# EAGLE design switch_7btn (EAGLE 6.6.0)
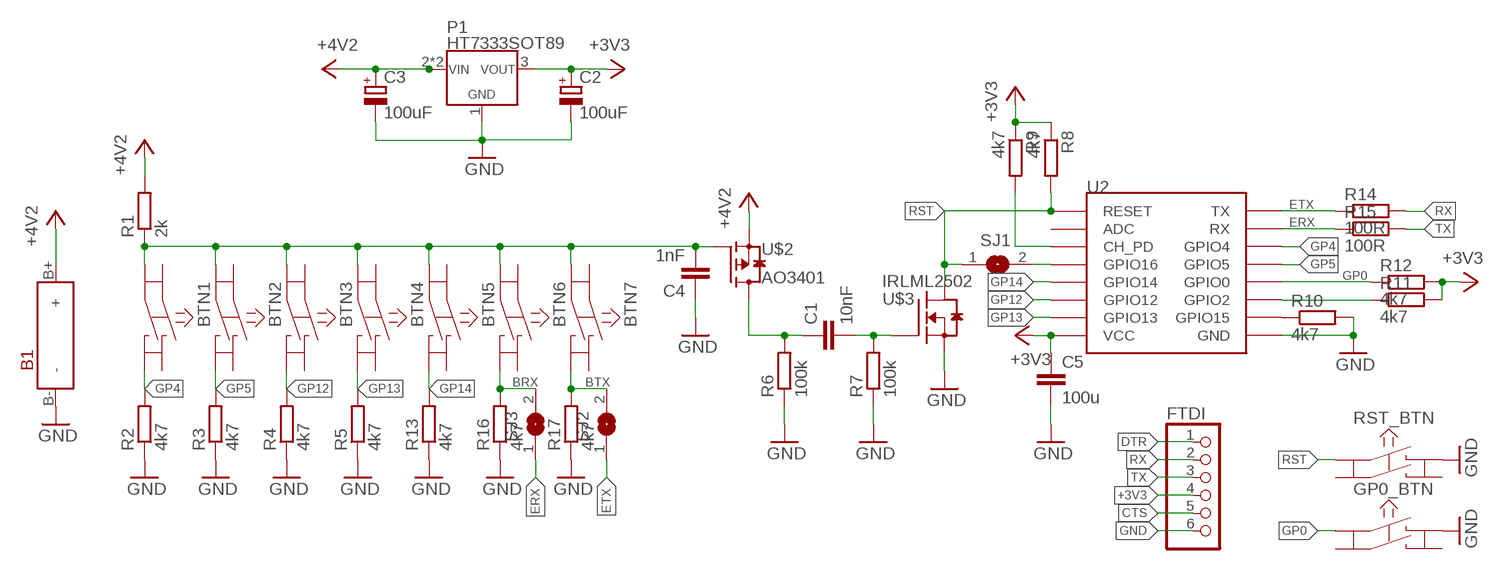
[diagram p0: schematic, sheet 1]

## Parts
B1  18650_1X  [18650_HOLDER_1X]
BTN1  KSM611A  [KSM611A]
BTN2  KSM611A  [KSM611A]
BTN3  KSM611A  [KSM611A]
BTN4  KSM611A  [KSM611A]
BTN5  KSM611A  [KSM611A]
BTN6  KSM611A  [KSM611A]
BTN7  KSM611A  [KSM611A]
C1  10nF  C-EU025-025X050  [C025-025X050]
C2  100uF  CPOL-EUE5-8.5  [E5-8,5]
C3  100uF  CPOL-EUE5-8.5  [E5-8,5]
C4  1nF  C-EU025-025X050  [C025-025X050]
C5  100u  C-EUC1206  [C1206]
FTDI  PINHD-1X06_2.54-S  [1X06-S]
GP0_BTN  KSM611A  [KSM611A]
P1  HT7333SOT89  [SOT89]
R1  2k  R-EU_MULTI  [MULTI_RESISTOR]
R2  4k7  R-EU_MULTI  [MULTI_RESISTOR]
R3  4k7  R-EU_MULTI  [MULTI_RESISTOR]
R4  4k7  R-EU_MULTI  [MULTI_RESISTOR]
R5  4k7  R-EU_MULTI  [MULTI_RESISTOR]
R6  100k  R-EU_MULTI  [MULTI_RESISTOR]
R7  100k  R-EU_MULTI  [MULTI_RESISTOR]
R8  4k7  R-EU_MULTI  [MULTI_RESISTOR]
R9  4k7  R-EU_MULTI  [MULTI_RESISTOR]
R10  4k7  R-EU_MULTI  [MULTI_RESISTOR]
R11  4k7  R-EU_MULTI  [MULTI_RESISTOR]
R12  4k7  R-EU_MULTI  [MULTI_RESISTOR]
R13  4k7  R-EU_MULTI  [MULTI_RESISTOR]
R14  100R  R-EU_MULTI  [MULTI_RESISTOR]
R15  100R  R-EU_MULTI  [MULTI_RESISTOR]
R16  4k7  R-EU_MULTI  [MULTI_RESISTOR]
R17  4k7  R-EU_MULTI  [MULTI_RESISTOR]
RST_BTN  KSM611A  [KSM611A]
SJ1  SJ  [SJ]
SJ2  SJ  [SJ]
SJ3  SJ  [SJ]
U2  ESP12SMD  [ESP12-SMD]
U$2  AO3401  P-CH_AO3401  [SOT23]
U$3  IRLML2502  N-CH_IRLML2502  [SOT23]

## Nets
+3V3: C2.+ C5.1 FTDI.4 P1.3(VOUT) R8.1@1 R8.1@2 R9.1@1 R9.1@2 R11.2@1 R11.2@2 R12.2@1 R12.2@2 U2.VCC
+5V: B1.B+(+) C3.+ P1.2(VIN) P1.2@1(VIN) R1.2@1 R1.2@2 U$2.2(S) ; supply symbol labelled +4V2
BRX: BTN6.D R16.2@1 R16.2@2 SJ3.2
BTX: BTN7.D R17.2@1 R17.2@2 SJ2.2
CTS: FTDI.5
DTR: FTDI.1
ERX: R15.1@1 R15.1@2 SJ3.1 U2.RXD0(RX)
ETX: R14.1@1 R14.1@2 SJ2.1 U2.TXD0(TX)
GND: B1.B-(-) C2.- C3.- C4.1 C5.2 FTDI.6 GP0_BTN.B P1.1(GND) R2.1@1 R2.1@2 R3.1@1 R3.1@2 R4.1@1 R4.1@2 R5.1@1 R5.1@2 R6.1@1 R6.1@2 R7.1@1 R7.1@2 R10.2@1 R10.2@2 R13.1@1 R13.1@2 R16.1@1 R16.1@2 R17.1@1 R17.1@2 RST_BTN.B U2.GND U$3.2(S)
GP0: GP0_BTN.A R12.1@1 R12.1@2 U2.GPIO0
GP4: BTN1.D R2.2@1 R2.2@2 U2.GPIO4
GP5: BTN2.D R3.2@1 R3.2@2 U2.GPIO5
GP12: BTN3.D R4.2@1 R4.2@2 U2.GPIO12
GP13: BTN4.D R5.2@1 R5.2@2 U2.GPIO13
GP14: BTN5.D R13.2@1 R13.2@2 U2.GPIO14
N$1: SJ1.2 U2.GPIO16
N$2: R9.2@1 R9.2@2 U2.CH_PD
N$3: C1.2 R7.2@1 R7.2@2 U$3.1(G)
N$4: R10.1@1 R10.1@2 U2.GPIO15
N$5: R11.1@1 R11.1@2 U2.GPIO2
N$7: C1.1 R6.2@1 R6.2@2 U$2.3(D)
N$8: BTN1.C BTN2.C BTN3.C BTN4.C BTN5.C BTN6.C BTN7.C C4.2 R1.1@1 R1.1@2 U$2.1(G)
RST: R8.2@1 R8.2@2 RST_BTN.A SJ1.1 U2.RESET U$3.3(D)
RX: FTDI.2 R14.2@1 R14.2@2
TX: FTDI.3 R15.2@1 R15.2@2
Unconnected: BTN1.A BTN1.B BTN2.A BTN2.B BTN3.A BTN3.B BTN4.A BTN4.B BTN5.A BTN5.B BTN6.A BTN6.B BTN7.A BTN7.B GP0_BTN.C GP0_BTN.D RST_BTN.C RST_BTN.D U2.ADC

## Library data of the parts
B1 = diyHue:18650_1X
BTN1-BTN7 GP0_BTN RST_BTN = schalter_taster:KSM611A
C1 C4 C5 = rcl:C-EU: CAPACITOR, European symbol
C2 C3 = rcl:CPOL-EU: POLARIZED CAPACITOR, European symbol
FTDI = pinhead-2:PINHD-1X06: PIN HEADER
P1 = diyHue:HT7333
R1-R17 = diyHue:R-EU_MULTI
SJ1-SJ3 = jumper:SJ: SMD solder JUMPER
U2 = esp8266modules:ESP12: ESP8266 Wifi module 12
U$2 = diyHue:P-CH_AO3401
U$3 = diyHue:N-CH_IRLML2502

## Board
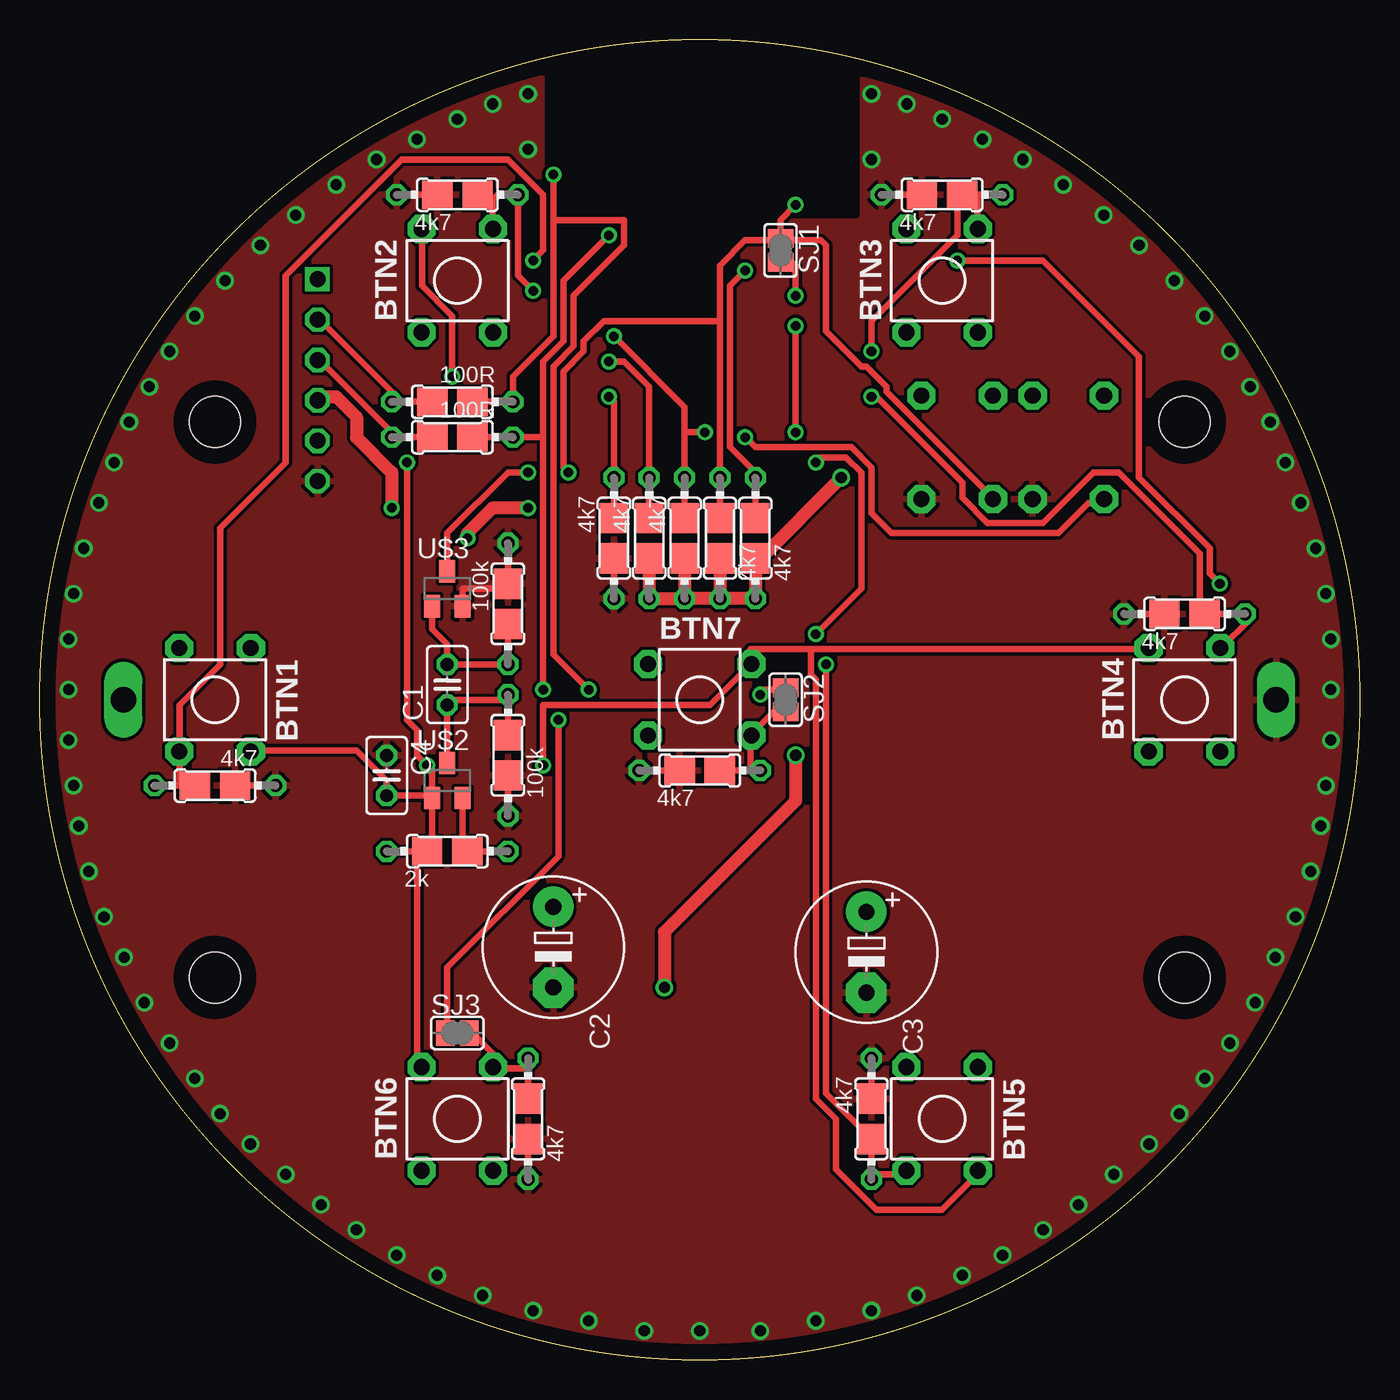
[diagram p1: board, top side]
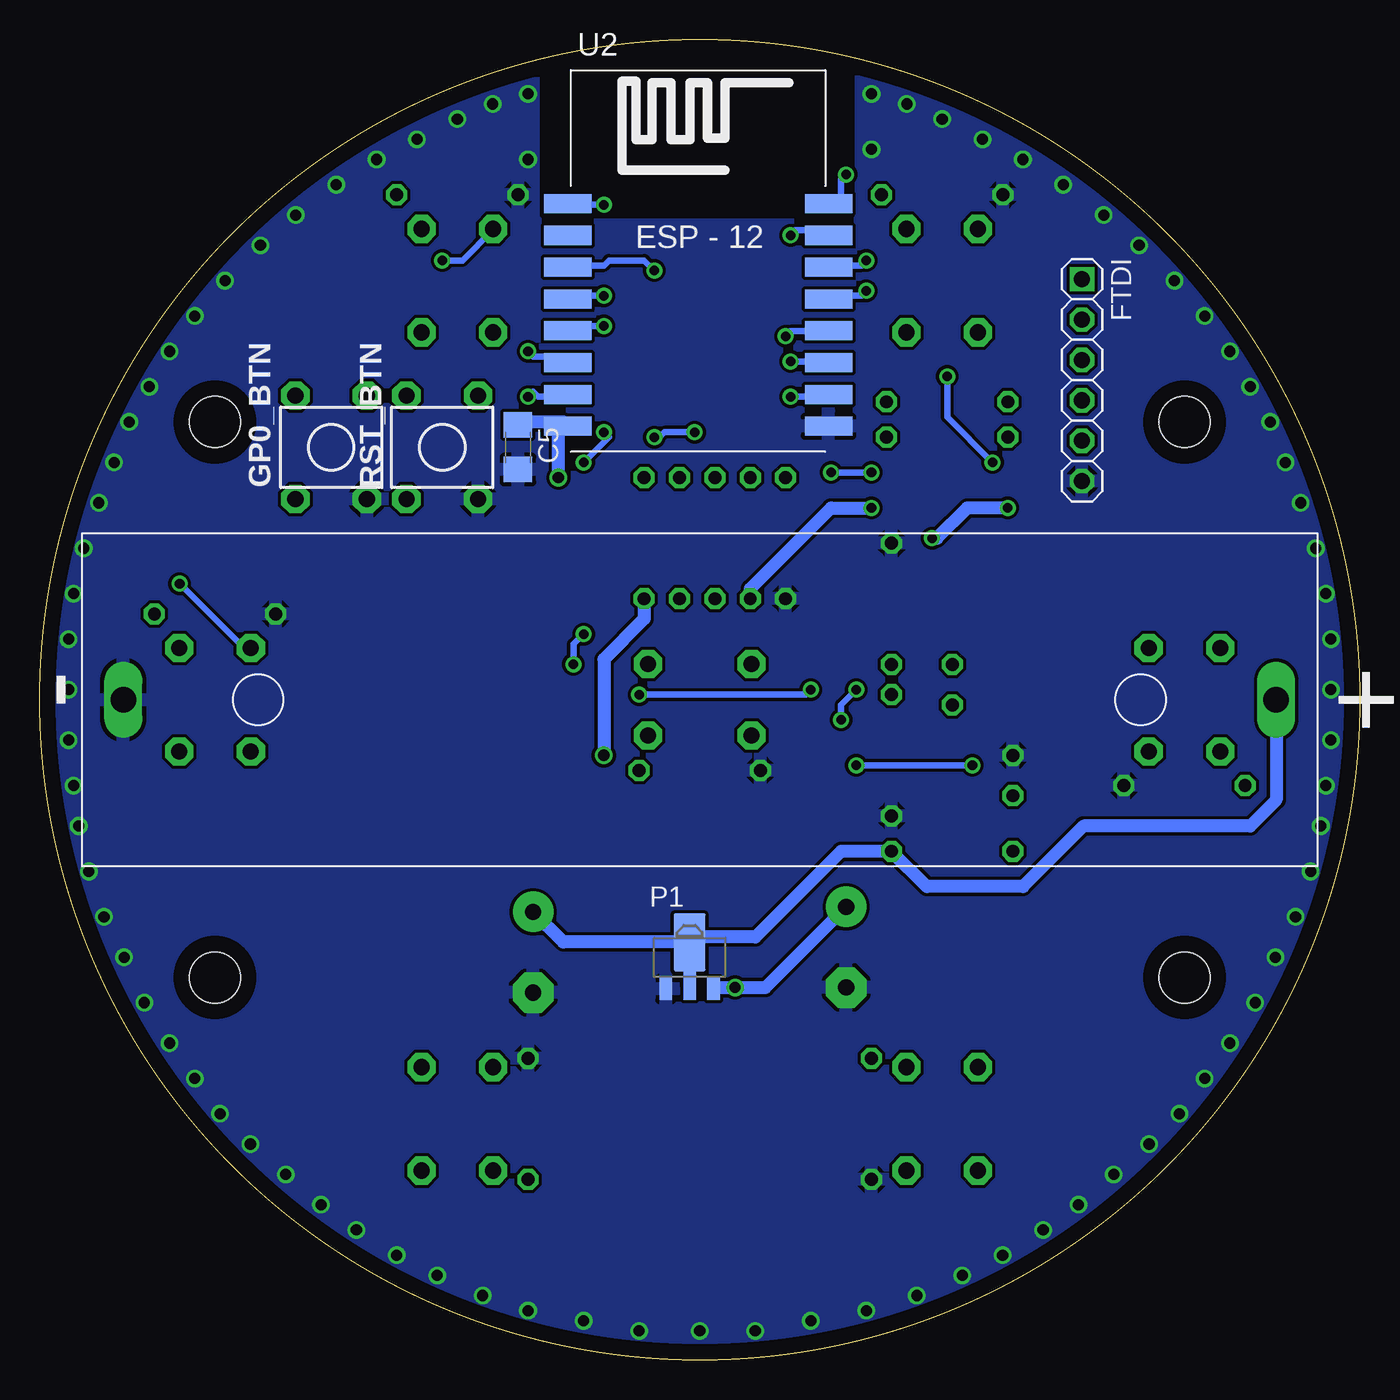
[diagram p2: board, bottom side, seen from below]

Size 83 x 83 mm. Coordinates in mm from the lower left corner, seen from the top.
Outline: circle at 41.5,41.5 radius 41.5
Copper layers (1*16): Top 0.035mm / dielectric 1.5mm / Bottom 0.035mm
Design rules "default *": minimum track width 10mil, minimum drill 0.5mm, track to track 8mil, track to pad 8mil, pad to pad 8mil, via to via 8mil, smd to smd 0mil, copper to edge 1mm, drill to drill 8mil, minimum pad ring 10mil, minimum via ring 8mil, stop-mask expansion 4mil, vias tented up to drill 1mm, thermal gap 10mil
Holes 3.2 mm at 11.02,24.04 71.98,24.04 71.98,58.96 11.02,58.96

### Footprints (pad centres in the part's own frame; a part is rotated, then mirrored left to right if it is on the bottom)
18650_HOLDER_1X = drill 1.6 long: B+ 37.52,0; B- -34.98,0
KSM611A = drill 1.016 pad 1.778 octagon: A -3.25,2.25; B -3.25,-2.25; C 3.25,2.25; D 3.25,-2.25
C025-025X050 = drill 0.813 octagon: 1 -1.27,0; 2 1.27,0
E5-8,5 = drill 1.016 pad 2.54: + -2.54,0 | drill 1.016 pad 2.54 octagon: - 2.54,0
C1206 = smd 1.6 x 1.8: 1 -1.4,0; 2 1.4,0
1X06-S = drill 1.016 square: 1 -6.35,0 | drill 1.016 octagon: 2 -3.81,0; 3 -1.27,0; 4 1.27,0; 5 3.81,0; 6 6.35,0
SOT89 = smd 0.8 x 1.4: 1 -1.499,-1.981; 3 1.499,-1.981 | smd 0.8 x 1.9: 2 0,-1.727 | smd 2.032 x 3.65: 2@1 0,0.94
MULTI_RESISTOR = drill 0.813 octagon: 1@1 -3.81,0; 2@1 3.81,0 | smd 1.905 x 1.803: 1@2 -1.266,0; 2@2 1.266,0
SJ = smd 1.168 x 1.6: 1 -0.762,0; 2 0.762,0
ESP12-SMD = smd 3 x 1.2: ADC -8.3,3.8; CH_PD -8.3,1.8; GND 8.1,-8.2; GPIO0 8.1,-2.2; GPIO2 8.1,-4.2; GPIO4 8.1,1.8; GPIO5 8.1,-0.2; GPIO12 -8.3,-4.2; GPIO13 -8.3,-6.2; GPIO14 -8.3,-2.2; GPIO15 8.1,-6.2; GPIO16 -8.3,-0.2; RESET -8.3,5.8; RXD0 8.1,3.8; TXD0 8.1,5.8; VCC -8.3,-8.2
SOT23 = smd 1 x 1.4: 1 -0.95,-1.1; 2 0.95,-1.1; 3 0,1.1

### Placement (x,y rotation side)
B1  42.77,41.5 0 bottom
BTN1  11.02,41.5 270 top
BTN2  26.26,67.85 90 top
BTN3  56.74,67.85 90 top
BTN4  71.98,41.5 90 top
BTN5  56.74,15.15 270 top
BTN6  26.26,15.15 90 top
BTN7  41.5,41.5 0 top
C1  25.62,42.45 90 top
C2  32.29,25.94 270 top
C3  51.98,25.62 270 top
C4  21.82,36.74 270 top
C5  52.93,57.38 270 bottom
FTDI  17.46,61.6 270 bottom
GP0_BTN  64.68,57.38 90 bottom
P1  42.13,25.31 0 bottom
R1  25.62,31.98 0 top
R2  11.02,36.1 180 top
R3  26.26,73.25 0 top
R4  56.74,73.25 0 top
R5  71.98,46.9 0 top
R6  29.44,38.01 90 top
R7  29.44,47.53 270 top
R8  42.77,51.66 90 top
R9  44.99,51.66 90 top
R10  36.1,51.66 270 top
R11  38.33,51.66 270 top
R12  40.55,51.66 270 top
R13  52.3,15.15 270 top
R14  25.94,60.23 180 top
R15  25.94,58.01 180 top
R16  30.7,15.15 90 top
R17  41.5,37.05 0 top
RST_BTN  57.69,57.38 90 bottom
SJ1  46.58,69.76 270 top
SJ2  46.9,41.5 270 top
SJ3  26.26,20.55 0 top
U2  41.5,66.9 0 bottom
U$2  25.62,36.42 0 top
U$3  25.62,48.48 0 top

### Tracks (layer width: path | path; a pad name or v marks a point on that pad's centre or on a via)
+3V3  (via drill 0.6, 0.7)
  Top 0.813: R12.2@1 R11.2@1 R11.2@2 | R8.1@1 R12.2@1 | R8.1@1 R9.1@1 R9.1@2 45.31,50.39 v50.39,55.47 | R8.1@2 R8.1@1 | R12.2@2 R12.2@1 | v39.28,23.4 39.28,26.89 47.53,35.15 v47.53,38.01 | v22.13,53.56 22.13,55.79 19.91,58.01 19.91,59.28 18.64,60.55 17.69,60.55 FTDI.4 | v26.89,51.66 26.89,51.98 28.48,53.56 v30.7,53.56
  Bottom 0.813: C5.1 52.93,58.96 50.07,58.96 U2.VCC 50.39,58.64 v50.39,55.47 | C2.+ 37.37,23.4 v39.28,23.4 40.55,23.4 P1.3 | v47.53,38.01 47.53,44.04 44.99,46.58 R9.1@1 | v22.13,53.56 24.67,53.56 26.58,51.66 v26.89,51.66 | v30.7,53.56 33.24,53.56 38.33,48.48 R11.2@1
+5V
  Top 0.406: R1.2@1 R1.2@2 26.58,31.98 26.58,35.15 U$2.2
  Bottom 0.813: P1.2@1 P1.2 | C3.+ 50.07,26.26 42.77,26.26 42.45,26.58 42.13,26.58 P1.2@1 | P1.2@1 41.82,26.58 38.01,26.58 32.61,31.98 R1.2@1 27.21,29.75 21.18,29.75 17.37,33.56 6.89,33.56 5.25,35.2 B1.B+
BRX
  Top 0.406: 30.7,18.32 R16.2@2 | 30.7,18.32 28.8,18.32 BTN6.D 28.48,18.64 28.48,19.27 27.21,20.55 SJ3.2 | 30.7,18.32 R16.2@1
BTX
  Top 0.406: 44.67,37.05 R17.2@2 | 44.67,37.05 44.67,38.96 BTN7.D 44.67,39.28 46.26,40.87 46.9,40.87 SJ2.2 | 44.67,37.05 R17.2@1
ERX  (via drill 0.6)
  Top 0.406: R15.1@2 R15.1@1 31.66,58.01 | 31.66,58.01 31.66,62.77 32.93,64.04 32.93,67.85 v35.78,70.71 | v32.61,40.23 32.61,31.66 25.62,24.67 25.62,20.55 SJ3.1 | 31.66,58.01 v31.66,42.13
  Bottom 0.406: v35.78,70.71 35.47,71.03 33.56,71.03 U2.RXD0 | v32.61,40.23 32.61,41.18 v31.66,42.13
ETX  (via drill 0.6)
  Top 0.406: R14.1@2 R14.1@1 29.75,61.82 32.29,64.36 32.29,71.66 | v32.29,74.52 32.29,71.66 | 32.29,71.66 36.74,71.66 36.74,70.08 33.56,66.9 33.56,63.73 32.29,62.45 32.29,44.36 v34.52,42.13 | v45.31,41.82 45.63,42.13 46.9,42.13 SJ2.1
  Bottom 0.406: v32.29,74.52 32.61,74.2 32.61,72.93 33.24,72.93 U2.TXD0 | v34.52,42.13 34.83,41.82 v45.31,41.82
GND  (via drill 0.7)
  Top 0.406: R3.1@2 R3.1@1 | R4.1@2 R4.1@1 | R10.2@2 R10.2@1 | R17.1@2 R17.1@1 | R5.1@2 R5.1@1 | R2.1@2 R2.1@1 | R6.1@2 R6.1@1 | U$3.2 26.58,47.53 26.58,48.48 29.44,48.48 R7.1@2 R7.1@1 | R16.1@1 R16.1@2 | R13.1@2 R13.1@1
  other vias: 13.88,70.08 16.1,71.98 18.64,73.88 21.18,75.47 23.72,76.74 26.26,78.01 28.48,78.97 30.7,79.6 11.66,67.85 9.75,65.63 8.16,63.41 6.89,61.19 5.62,58.96 4.67,56.42 3.72,53.88 2.77,51.02 2.13,48.17 1.81,45.31 1.81,42.13 1.81,38.96 2.13,36.1 2.45,33.56 3.08,30.7 4.03,27.85 5.3,25.31 6.58,22.45 8.16,19.91 9.75,17.69 11.34,15.46 13.24,13.56 15.46,11.66 17.69,9.75 19.91,8.16 22.45,6.58 24.99,5.3 27.85,4.03 31.02,3.08 34.52,2.45 38.01,1.81 41.5,1.81 45.31,1.81 69.12,70.08 66.9,71.98 64.36,73.88 61.82,75.47 59.28,76.74 56.74,78.01 54.52,78.97 52.3,79.6 71.34,67.85 73.25,65.63 74.84,63.41 76.11,61.19 77.38,58.96 78.33,56.42 79.28,53.88 80.23,51.02 80.87,48.17 81.19,45.31 81.19,42.13 81.19,38.96 80.87,36.1 80.55,33.56 79.92,30.7 78.97,27.85 77.69,25.31 76.42,22.45 74.84,19.91 73.25,17.69 71.66,15.46 69.76,13.56 67.53,11.66 65.31,9.75 63.09,8.16 60.55,6.58 58.01,5.3 55.15,4.03 52.3,3.08 48.8,2.45 30.7,76.11 52.3,75.47
  pour Bottom: -0.09,85.31 84.05,85.31 84.05,-2.63 -0.09,-2.63
  pour Bottom: -0.73,85.31 83.41,85.31 83.41,-2.63 -0.73,-2.63
  pour Top: -1.68,85.31 82.46,85.31 82.46,-2.63 -1.68,-2.63
GP0  (via drill 0.6)
  Top 0.406: R12.1@2 R12.1@1 40.55,58.33 | 40.55,58.33 40.55,59.91 v36.1,64.36 | v44.36,58.01 44.99,57.38 51.02,57.38 52.3,56.11 52.3,53.25 53.56,51.98 64.04,51.98 65.95,53.88 66.9,53.88 GP0_BTN.A | 40.55,58.33 v41.82,58.33
  Bottom 0.406: v36.1,64.36 35.78,64.68 33.56,64.68 U2.GPIO0 | v44.36,58.01 44.04,58.01 43.72,58.33 v41.82,58.33
GP4  (via drill 0.6)
  Top 0.406: R2.2@1 8.8,36.1 | 8.8,36.1 R2.2@2 | 8.8,36.1 8.8,38.01 BTN1.D 8.8,38.33 8.8,41.18 11.34,43.72 11.34,52.3 15.46,56.42 15.46,68.17 22.77,75.47 29.44,75.47 31.66,73.25 31.66,69.76 v31.02,69.12
  Bottom 0.406: v31.02,69.12 31.34,68.81 33.24,68.81 U2.GPIO4
GP5  (via drill 0.6)
  Top 0.406: 28.48,72.93 28.48,71.34 BTN2.D | 28.48,72.93 28.16,73.25 R3.2@2 | 28.48,72.93 28.8,73.25 R3.2@1 30.07,68.17 v31.02,67.22
  Bottom 0.406: v31.02,67.22 31.34,66.9 33.24,66.9 U2.GPIO5
GP12  (via drill 0.6)
  Top 0.406: 58.96,73.25 R4.2@2 57.69,73.25 57.69,70.71 52.3,65.31 v52.3,63.41 | 58.96,73.25 58.96,71.34 BTN3.D | R4.2@1 58.96,73.25
  Bottom 0.406: v52.3,63.41 51.98,63.09 50.07,63.09 U2.GPIO12
GP13  (via drill 0.6)
  Top 0.406: BTN4.D 74.52,44.99 75.79,46.26 R5.2@1 R5.2@2 72.93,46.9 72.93,50.71 67.85,55.79 66.27,55.79 63.09,52.61 59.6,52.61 58.01,54.2 58.01,55.15 52.61,60.55 v52.3,60.55
  Bottom 0.406: v52.3,60.55 51.98,60.87 51.66,60.55 50.07,60.55 U2.GPIO13
GP14  (via drill 0.6)
  Top 0.406: 52.3,11.66 54.2,11.66 BTN5.D | 52.3,11.66 R13.2@2 | 52.3,11.66 R13.2@1 | v47.53,58.33 v47.53,65 | v49.44,43.72 49.44,16.73 R13.2@2 | R13.2@2 | v48.8,56.42 48.8,56.74 50.71,56.74 51.66,55.79 51.66,48.48 v48.8,45.63
  Bottom 0.406: v47.53,65 49.76,65 U2.GPIO14 | v47.53,58.33 47.22,58.01 v48.8,56.42 | v48.8,45.63 49.44,44.99 v49.44,43.72
N$1  (via drill 0.6)
  Top 0.406: v47.53,66.9 47.53,68.81 47.22,69.12 46.58,69.12 SJ1.2
  Bottom 0.406: v47.53,66.9 49.76,66.9 U2.GPIO16
N$2  (via drill 0.6)
  Top 0.406: R9.2@2 R9.2@1 44.99,55.79 43.41,57.38 43.41,67.53 v44.36,68.49
  Bottom 0.406: v44.36,68.49 44.99,69.12 47.22,69.12 47.53,68.81 49.76,68.81 U2.CH_PD
N$3
  Top 0.406: R7.2@2 R7.2@1 C1.2 25.62,44.99 24.67,45.95 24.67,47.22 U$3.1
N$4  (via drill 0.6)
  Top 0.406: R10.1@2 R10.1@1 36.1,60.23 v35.78,60.55
  Bottom 0.406: v35.78,60.55 33.56,60.55 U2.GPIO15
N$5  (via drill 0.6)
  Top 0.406: R11.1@2 R11.1@1 38.33,61.19 36.74,62.77 v35.78,62.77
  Bottom 0.406: v35.78,62.77 33.56,62.77 U2.GPIO2
N$6
  cutout Bottom: 31.98,83.73 51.34,83.73 51.34,71.98 31.98,71.98
  cutout Top: 31.98,83.73 51.34,83.73 51.34,71.98 31.98,71.98
N$7
  Top 0.406: U$2.3 C1.1 25.62,41.5 29.44,41.5 | 29.44,41.5 R6.2@2 | 29.44,41.5 R6.2@1
N$8  (via drill 0.6)
  Top 0.406: 23.72,31.98 R1.1@1 | U$2.1 24.67,35.15 24.67,31.98 R1.1@2 23.72,31.98 | U$2.1 24.53,35.47 C4.2 21.82,36.42 19.91,38.33 13.56,38.33 BTN1.C | 23.72,31.98 23.72,18.64 BTN6.C | 48.48,44.67 44.67,44.67 44.67,44.04 BTN7.C 44.67,43.72 42.13,41.18 31.66,41.18 v31.66,37.37 | 48.48,44.67 69.44,44.67 BTN4.C | U$2.1 24.67,35.47 24.67,37.05 v24.36,37.37 23.72,38.01 23.72,39.59 23.09,40.23 v23.09,56.42 | v57.69,69.12 63.09,69.12 69.12,63.09 69.12,55.47 73.57,51.02 73.57,49.44 v74.2,48.8 | v25.94,61.82 25.94,65.63 24.04,67.53 24.04,71.03 BTN2.C | BTN5.C 58.96,11.66 56.74,9.43 52.61,9.43 50.07,11.97 50.07,15.15 48.8,16.42 48.8,42.77 48.48,43.09 48.48,44.67
  Bottom 0.406: v24.36,37.37 v31.66,37.37 | v57.69,69.12 56.42,69.12 54.52,71.03 BTN3.C | v74.2,48.8 70.08,44.67 69.76,44.67 BTN4.C | v25.94,61.82 25.94,59.28 v23.09,56.42
RST  (via drill 0.6)
  Top 0.406: R8.2@2 R8.2@1 42.77,65.31 | 42.77,65.31 42.77,68.81 44.36,70.39 46.58,70.39 | v47.53,72.61 46.58,71.66 SJ1.1 46.58,70.39 | v33.24,55.79 32.93,56.11 32.93,62.14 34.2,63.41 34.2,64.04 35.47,65.31 42.77,65.31 | v30.7,55.79 29.44,55.79 25.62,51.98 U$3.3 | 46.58,70.39 49.12,70.39 49.44,70.08 49.44,64.68 51.66,62.45 51.98,62.45 53.25,61.19 53.25,60.87 59.91,54.2 RST_BTN.A
  Bottom 0.406: v47.53,72.61 49.76,72.61 U2.RESET | v33.24,55.79 v30.7,55.79
RX
  Top 0.406: R14.2@2 22.77,60.23 | 22.77,60.23 17.69,65.31 FTDI.2 | 22.77,60.23 R14.2@1
TX
  Top 0.406: R15.2@2 22.45,58.01 | 22.45,58.01 17.69,62.77 FTDI.3 | 22.45,58.01 R15.2@1